# EasyEDA schematic SUNRISE_EasyEDA.json
TITLE: SUNRISE CLOCK; REV: 1.0; Date: 2019-10-11; Sheet: 1/1; Drawn By: pauljohnleonard; Company: Longground Productions
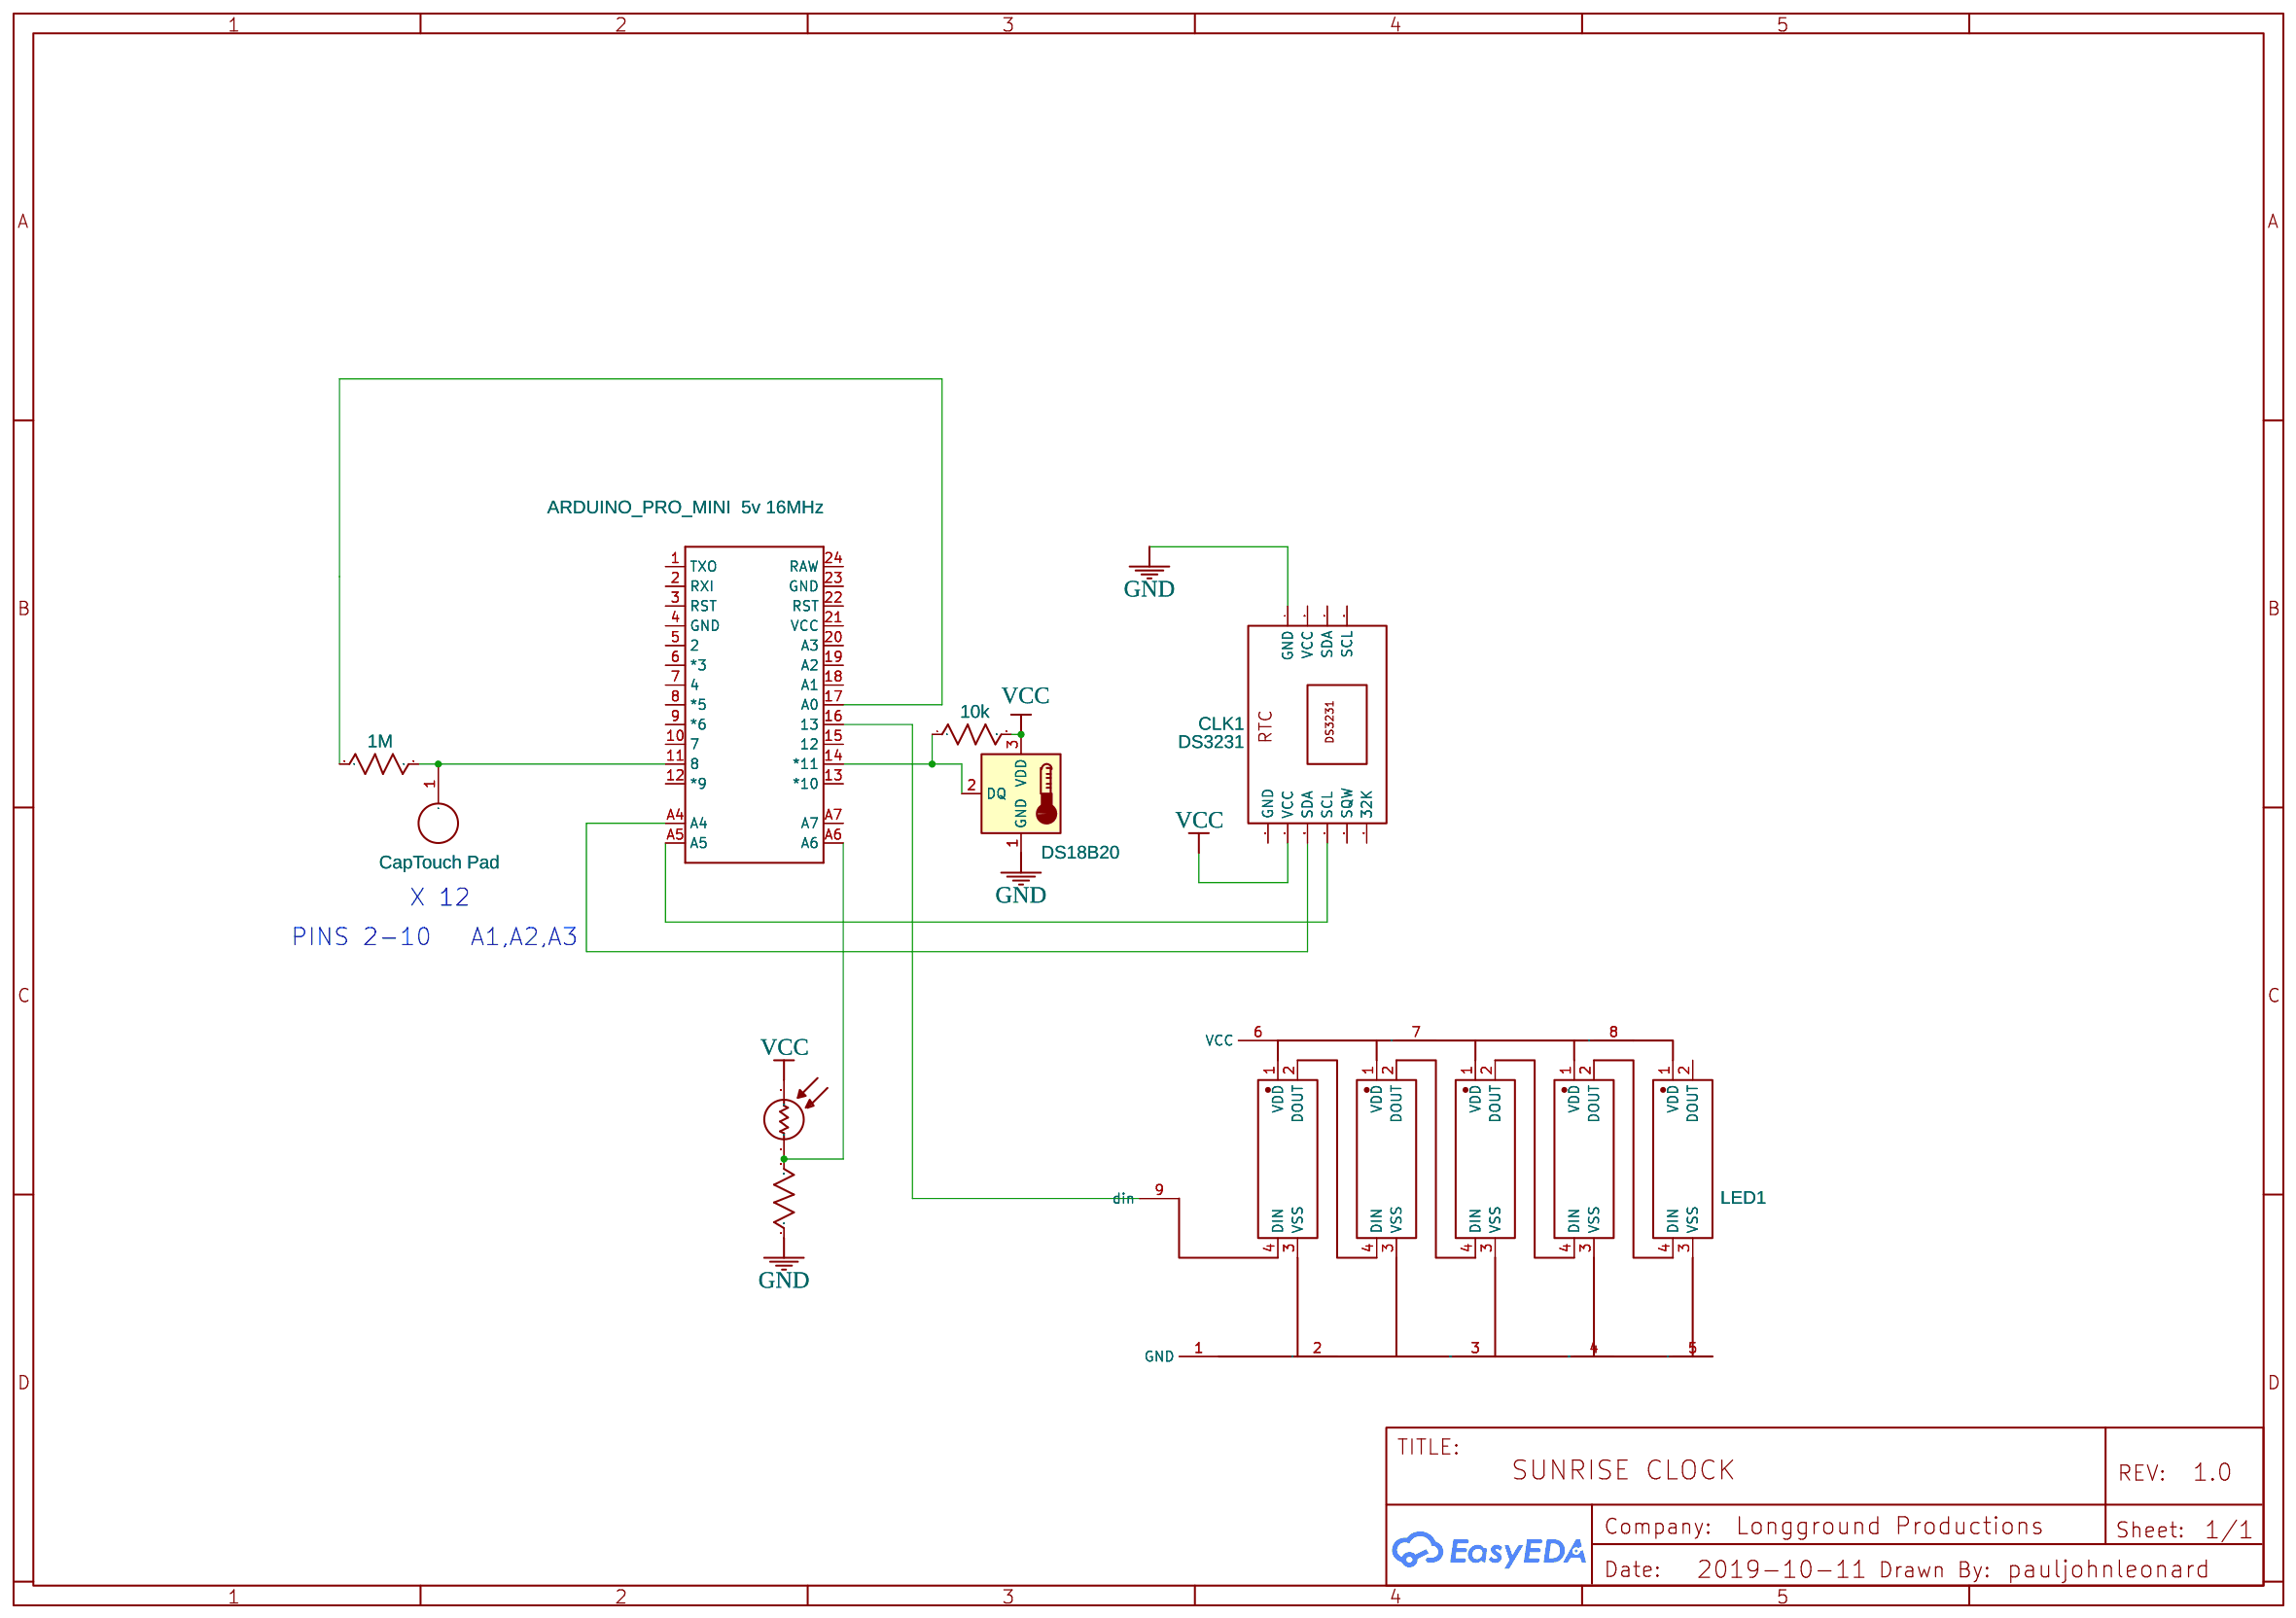
[diagram p0: schematic sheet]

## Parts
CLK1  DS3231  [RTC ZS-042 / DS3231]
LDR1  Photo-Resistor  [NSL-TO58]
LED1  схема коннектора для неопиксельного клинка,нижняя часть  [LED-3535_4P]
R1  1M  [AXIAL-0.3]
R2  1k  [AXIAL-0.3]
R3  10k  [AXIAL-0.3]
U1  ARDUINO_PRO_MINI  5v 16MHz  [ARDUINO_PRO_MINI]
U2  CapTouch Pad  [TOUCHPADROUND_V1]
U3  DS18B20  [TO-92_INLINE]

## Library data of the parts
CLK1 = -: Contributor: shocc
LDR1 = -: sourceId: iyQK2jdvN
LED1 = -: Supplier: LCSC; Manufacturer: Worldsemi; Manufacturer Part: WS2812B-3535; Contributor: Kirito122125; Supplier Part: C114583
R1-R3 = Res_AXIAL-0.3(1/8W)_US
U1 = -: Contributor: SparkFun
U2 = -: Contributor: dahud.lefthanded
U3 = -: Contributor: Arnaud Schaer

## Nets
GND: CLK1.4(GND) R2.1 U3.1(GND)
VCC: CLK1.9(VCC) LDR1.1A(1) R3.2 U3.3(VDD)
Net-(CLK1-8): CLK1.8(SDA) U1.A4
Net-(CLK1-11): CLK1.11(SCL) U1.A5
Net-(LDR1-2A): LDR1.2A(2) R2.2 U1.A6
Net-(R1-1): R1.1 U1.17(A0)
Net-(R1-2): R1.2 U1.11(8) U2.1
Net-(R3-1): R3.1 U1.14(*11) U3.2(DQ)

Not connected (* = marked no-connect by the designer): CLK1 2(SDA) 3(VCC) 5(SQW) 10(GND); LED1 1(GND) 2(GND) 3(GND) 4(GND) 5(GND) 6(VCC) 7(VDD) 8(VDD) 9(din); U1 1(TXO) 2(RXI) 3(RST) 4(GND) 5(2) 6(*3) 7(4) 8(*5) 9(*6) 10(7) 12(*9) 13(*10) 15(12) 16(13) 18(A1) 19(A2) 20(A3) 21(VCC) 22(RST) 23(GND) 24(RAW) A7

## Notes on the sheet
- X 12
- PINS 2-10   A1,A2,A3
